# Altium schematic sheet CW308T_PSoC62_UFO.SchDoc: CW308T-PSOC62 UFO Connections
size Letter; Organization: NewAE Technology Inc.; Address1: 1083 Queen St., Suite 196; Address2: Halifax; Address3: NS; Address4: Canada B3H 0B2; SheetNumber: 2; SheetTotal: 2; SheetApproved: YES
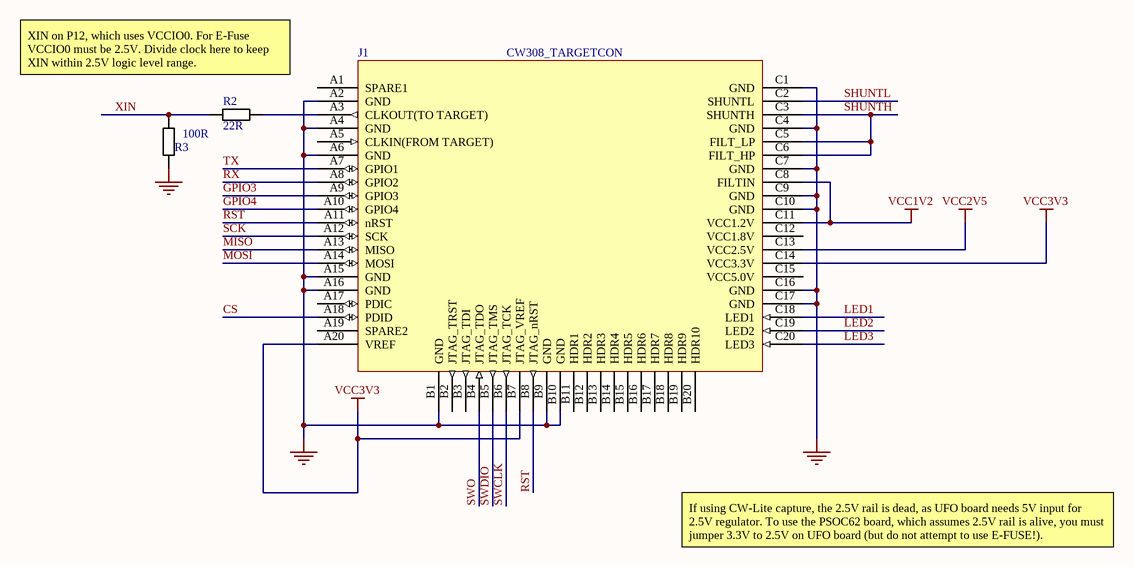
[diagram p0: CW308T_PSoC62_UFO.SchDoc]

## Parts
J1  CW308_TARGETCON  [CW308_TBOARD_CONN]
R2  22R  [RESC1608X55N]
R3  100R  [RESC1608X55N]

## Nets
GND: J1.A2(GND) J1.A4(GND) J1.A6(GND) J1.A15(GND) J1.A16(GND) J1.B1(GND) J1.B9(GND) J1.B10(GND) J1.C1(GND) J1.C4(GND) J1.C7(GND) J1.C9(GND) J1.C10(GND) J1.C16(GND) J1.C17(GND) R3.1
VCC1V2: J1.C8(FILTIN) J1.C11(VCC1.2V)
VCC2V5: J1.C13(VCC2.5V)
VCC3V3: J1.A20(VREF) J1.B7(JTAG_VREF) J1.C14(VCC3.3V)
CS: J1.A18(PDID)
GPIO3: J1.A9(GPIO3)
GPIO4: J1.A10(GPIO4)
LED1: J1.C18(LED1)
LED2: J1.C19(LED2)
LED3: J1.C20(LED3)
MISO: J1.A13(MISO)
MOSI: J1.A14(MOSI)
RST: J1.A11(nRST) J1.B8(JTAG_nRST)
RX: J1.A8(GPIO2)
SCK: J1.A12(SCK)
SHUNTH: J1.C3(SHUNTH) J1.C5(FILT_LP) J1.C6(FILT_HP)
SHUNTL: J1.C2(SHUNTL)
SWCLK: J1.B6(JTAG_TCK)
SWDIO: J1.B5(JTAG_TMS)
SWO: J1.B4(JTAG_TDO)
TX: J1.A7(GPIO1)
XIN: R2.1 R3.2
NetJ1_A3: J1.A3(CLKOUT(TO_TARGET)) R2.2

Not connected (* = marked no-connect by the designer): J1 A1(SPARE1) A5(CLKIN(FROM_TARGET)) A17(PDIC) A19(SPARE2) B2(JTAG_TRST) B3(JTAG_TDI) B11(HDR1) B12(HDR2) B13(HDR3) B14(HDR4) B15(HDR5) B16(HDR6) B17(HDR7) B18(HDR8) B19(HDR9) B20(HDR10) C12(VCC1.8V) C15(VCC5.0V)

## Notes on the sheet
- XIN on P12, which uses VCCIO0. For E-Fuse VCCIO0 must be 2.5V. Divide clock here to keep XIN within 2.5V logic level range.
- If using CW-Lite capture, the 2.5V rail is dead, as UFO board needs 5V input for 2.5V regulator. To use the PSOC62 board, which assumes 2.5V rail is alive, you must jumper 3.3V to 2.5V on UFO board (but do not attempt to use E-FUSE!).
- Title:
- Date:
- Rev:
- Time:
- Project:
- Sheet
- of
- License:
- Copyright © NewAE Technology Inc.
- Approved:
- NewAE.com
- File:

## Library data of the parts
J1 = CW308_TBOARD: CW308 "Standard" Target Board Connector; Component Group: Mechanical; Pitch: 2.54mm; Part Number: CW308_TBOARD; Pin Count: 60; Mounting Technology: Through-hole; Component Kind: Standard; Component Type: Standard
R2 = RCHIP-22R-0603: 22R res, 0603, 1%, 1/10W; Manufacture 1: Yageo; Manufacture Part Number 1: RC0603FR-0722RL; Component Group: Resistor; Case-EIA: 0603; Case-Metric: 1608; Rated Power: 0.1W; Rated Voltage: 75VDC; Part Number: RCHIP-22R-0603; Footprint: 0603; Pin Count: 2; Supplier 1: Digi-Key; Supplier Part Number 1: 311-22.0HRCT-ND; Value: 22R; Tolerance: 1%; Mounting Technology: SMT; Temperature Range: -55C to 155C; Component Kind: Standard; Component Type: Standard
R3 = RCHIP-100R-0603: 100R res, 0603, 1%, 1/10W; Manufacture 1: Yageo; Manufacture Part Number 1: RC0603FR-07100RL; Component Group: Resistor; Case-EIA: 0603; Case-Metric: 1608; Rated Power: 0.1W; Rated Voltage: 75VDC; Part Number: RCHIP-100R-0603; Footprint: 0603; Pin Count: 2; Supplier 1: Digi-Key; Supplier Part Number 1: 311-100HRCT-ND; Value: 100R; Tolerance: 1%; Mounting Technology: SMT; Temperature Range: -55C to 155C; Component Kind: Standard; Component Type: Standard